# Altium schematic sheet Digital_GPIO.SchDoc: Digital GPIO
size A4; SheetNumber: 5; SheetTotal: 6
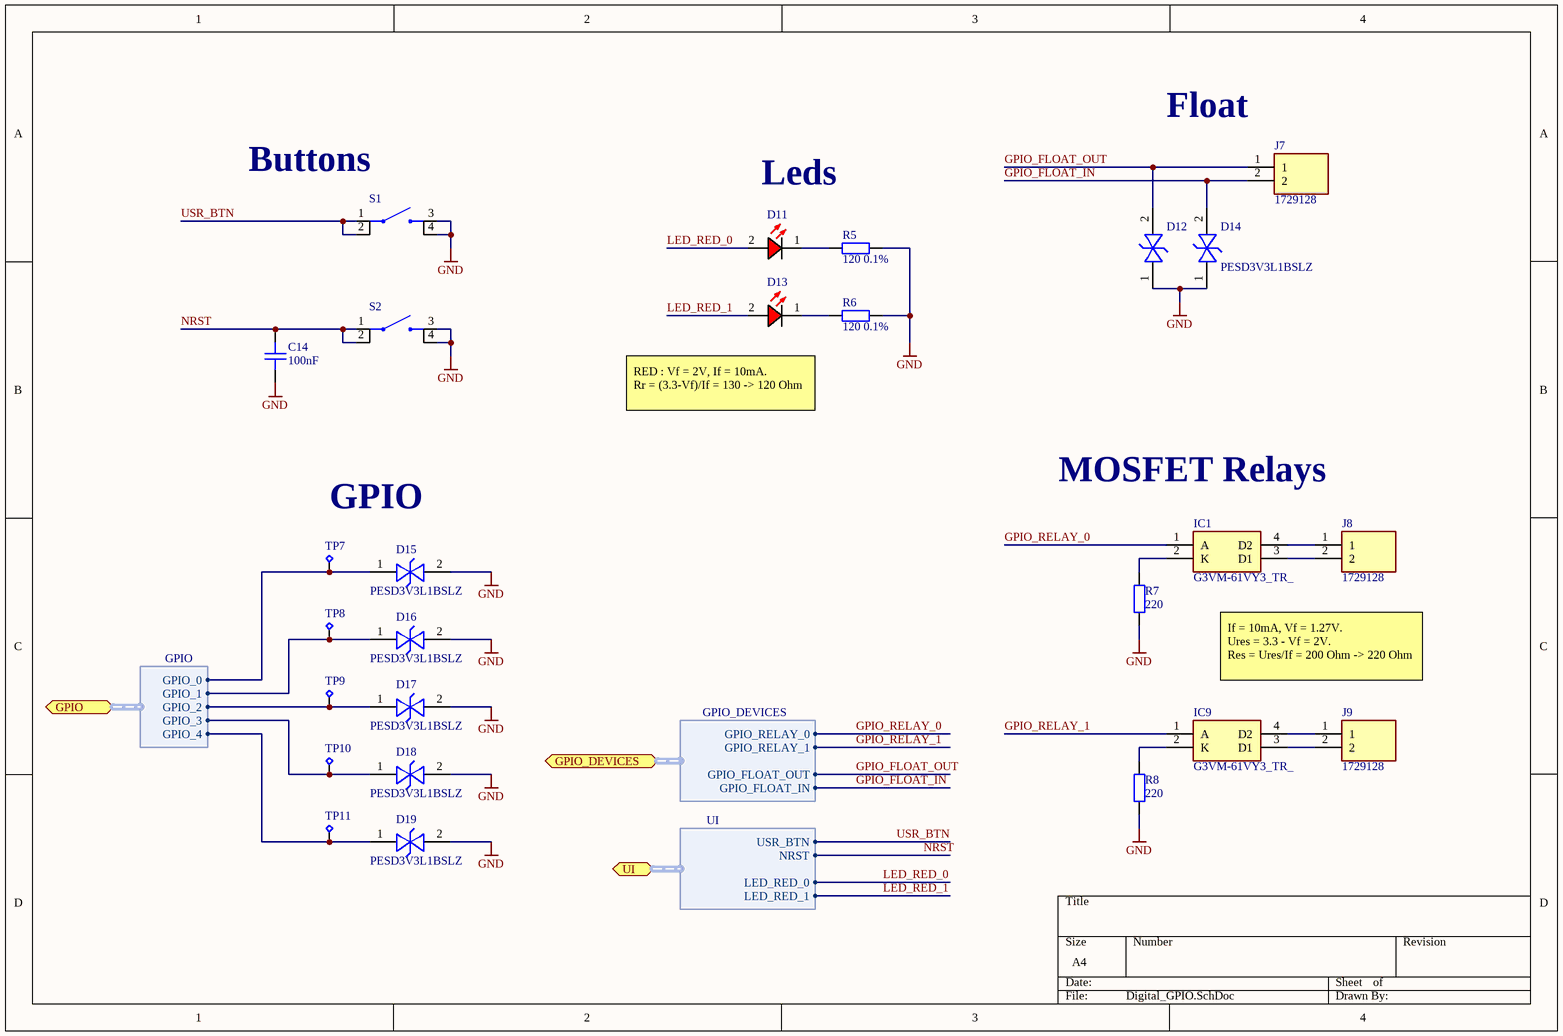
[diagram p0: Digital_GPIO.SchDoc]

## Parts
C14  100nF  [CAPC1005X05N]
D11  LTST-C171KRKT  [LTST-C171]  (value not drawn)
D12  PESD3V3L1BSLZ  [PESD3V3L1BSLZ]  (value not drawn)
D13  LTST-C171KRKT  [LTST-C171]  (value not drawn)
D14  PESD3V3L1BSLZ  [PESD3V3L1BSLZ]
D15  PESD3V3L1BSLZ  [PESD3V3L1BSLZ]
D16  PESD3V3L1BSLZ  [PESD3V3L1BSLZ]
D17  PESD3V3L1BSLZ  [PESD3V3L1BSLZ]
D18  PESD3V3L1BSLZ  [PESD3V3L1BSLZ]
D19  PESD3V3L1BSLZ  [PESD3V3L1BSLZ]
IC1  G3VM-61VY3_TR_  [G3VM61VY3TR]
IC9  G3VM-61VY3_TR_  [G3VM61VY3TR]
J7  1729128  [1729128]
J8  1729128  [1729128]
J9  1729128  [1729128]
R5  120 0.1%  [RESC2012X05N]
R6  120 0.1%  [RESC2012X05N]
R7  220  [RESC1608X04N]
R8  220  [RESC1608X04N]
S1  PTS645SL43SMTR92LFS  [PTS645SL43SMTR92LFS]  (value not drawn)
S2  PTS645SL43SMTR92LFS  [PTS645SL43SMTR92LFS]  (value not drawn)
TP7  5117  [5117]  (value not drawn)
TP8  5117  [5117]  (value not drawn)
TP9  5117  [5117]  (value not drawn)
TP10  5117  [5117]  (value not drawn)
TP11  5117  [5117]  (value not drawn)

## Ports
GPIO (bidir, harness GPIO), GPIO_DEVICES (bidir, harness GPIO_DEVICES), UI (bidir, harness UI)

## Harnesses
GPIO: GPIO_0, GPIO_1, GPIO_2, GPIO_3, GPIO_4
GPIO_DEVICES: GPIO_RELAY_0, GPIO_RELAY_1, GPIO_FLOAT_OUT, GPIO_FLOAT_IN
UI: USR_BTN, NRST, LED_RED_0, LED_RED_1

## Nets
GND: C14.2 D12.1(K1) D14.1(K1) D15.2(K2) D16.2(K2) D17.2(K2) D18.2(K2) D19.2(K2) R5.2 R6.2 R7.1 R8.1 S1.3 S1.4 S2.3 S2.4
GPIO_FLOAT_IN: D14.2(K2) J7.2 ; port GPIO_DEVICES.GPIO_FLOAT_IN
GPIO_FLOAT_OUT: D12.2(K2) J7.1 ; port GPIO_DEVICES.GPIO_FLOAT_OUT
GPIO_RELAY_0: IC1.1(A) ; port GPIO_DEVICES.GPIO_RELAY_0
GPIO_RELAY_1: IC9.1(A) ; port GPIO_DEVICES.GPIO_RELAY_1
LED_RED_0: D11.2(A) ; port UI.LED_RED_0
LED_RED_1: D13.2(A) ; port UI.LED_RED_1
NRST: C14.1 S2.1 S2.2 ; port UI.NRST
USR_BTN: S1.1 S1.2 ; port UI.USR_BTN
NetD11_1: D11.1(K) R5.1
NetD13_1: D13.1(K) R6.1
NetD15_1: D15.1(K1) TP7.1 ; port GPIO.GPIO_0
NetD16_1: D16.1(K1) TP8.1 ; port GPIO.GPIO_1
NetD17_1: D17.1(K1) TP9.1 ; port GPIO.GPIO_2
NetD18_1: D18.1(K1) TP10.1 ; port GPIO.GPIO_3
NetD19_1: D19.1(K1) TP11.1 ; port GPIO.GPIO_4
NetIC1_2: IC1.2(K) R7.2
NetIC1_3: IC1.3(D1) J8.2
NetIC1_4: IC1.4(D2) J8.1
NetIC9_2: IC9.2(K) R8.2
NetIC9_3: IC9.3(D1) J9.2
NetIC9_4: IC9.4(D2) J9.1

## Notes on the sheet
- (near S1) Buttons
- (near J7) Float
- Leds
- RED : Vf = 2V, If = 10mA.
  Rr = (3.3-Vf)/If = 130 -> 120 Ohm
- GPIO
- MOSFET Relays
- If = 10mA, Vf = 1.27V.
  Ures = 3.3 - Vf = 2V.
  Res = Ures/If = 200 Ohm -> 220 Ohm

## Library data of the parts
C14 = CMP-0003371-1: 100nF 10% 50V Ceramic Capacitor X8L 0402 (1005 Metric); Value: 100nF; Max Operating Temperature: 150°C; Case/Package: 0402 (1005 Metric); Temperature Coefficient: X8L; Mounting Technology: Surface Mount; Voltage Rating: 50V; Min Operating Temperature: -55°C; RoHS Compliant: Yes; Tolerance: 10%
D11 D13 = CMP-0002115-5: Single Color LED, Red, Water Clear, 1.4mm; Forward Voltage: 2V; Viewing Angle: 130°; Color: Red; Case/Package: 0805 (2012 Metric); Max Operating Temperature: 85°C; Mounting Technology: Surface Mount; RoHS Compliant: Yes; Min Operating Temperature: -55°C
D12 D14-D19 = PESD3V3L1BSLZ: Diode ESD (Bi-directional); Manufacturer_Name: Nexperia; Datasheet Link: https://assets.nexperia.com/documents/data-sheet/PESD3V3L1BSL.pdf; Height: 0.45mm; Manufacturer_Part_Number: PESD3V3L1BSLZ; Mouser Part Number: 771-PESD3V3L1BSLZ; Mouser Price/Stock: https://www.mouser.co.uk/ProductDetail/Nexperia/PESD3V3L1BSLZ?qs=Li%252BoUPsLEnsrB%2FnSgNrAWw%3D%3D
IC1 IC9 = G3VM-61VY3_TR_: Integrated Circuit; Manufacturer_Name: Omron Electronics; Manufacturer_Part_Number: G3VM-61VY3(TR); Datasheet Link: https://pt.mouser.com/datasheet/2/307/omron_04102018_G3VM-6_G__61VY1_DS_E-1317117.pdf; Height: 2.5mm; Mouser Part Number: 653-G3VM-61VY3TR; Mouser Price/Stock: https://www.mouser.co.uk/ProductDetail/Omron-Electronics/G3VM-61VY3TR?qs=F5EMLAvA7IDWDr%252BrEjvwmw%3D%3D; Arrow Part Number: G3VM-61VY3(TR); Arrow Price/Stock: https://www.arrow.com/en/products/g3vm-61vy3-tr/omron?utm_currency=USD&region=nac
J7-J9 = 1729128: Connector; Manufacturer_Name: Phoenix Contact; Datasheet Link: http://www.phoenixcontact.net/product/1729128; Height: 10.15mm; Manufacturer_Part_Number: 1729128; Mouser Part Number: 651-1729128; Mouser Price/Stock: https://www.mouser.co.uk/ProductDetail/Phoenix-Contact/1729128?qs=GFUSqQMLmmnCBVBY3dts9w%3D%3D; Arrow Part Number: 1729128; Arrow Price/Stock: https://www.arrow.com/en/products/1729128/phoenix-contact?region=nac; System: Connector
R5 = CMP-0005383-3: 120 Ohms ±0.1% 0.125W, 1/8W Chip Resistor 0805 (2012 Metric) Thin Film / RT0805BRD07120RL; Resistor Series: E24; Temperature Coefficient: 25ppm/°C; Value: 120; Power: 125mW; Voltage Rating: 150V; RoHS Compliant: Yes; Max Operating Temperature: 155°C; Case/Package: 0805 (2012 Metric); Mounting Technology: Surface Mount; Min Operating Temperature: -55°C; Tolerance: 0.1%
R6 = CMP-0005383-3: 120 Ohms ±0.1% 0.125W, 1/8W Chip Resistor 0805 (2012 Metric) Thin Film; Resistor Series: E24; Temperature Coefficient: 25ppm/°C; Value: 120; Power: 125mW; Voltage Rating: 150V; RoHS Compliant: Yes; Max Operating Temperature: 155°C; Case/Package: 0805 (2012 Metric); Mounting Technology: Surface Mount; Min Operating Temperature: -55°C; Tolerance: 0.1%
R7 R8 = CMP-0001959-3: 220 Ohms ±1% 0.1W, 1/10W Chip Resistor 0603 (1608 Metric) Moisture Resistant Thick Film; Temperature Coefficient: 200ppm/°C; Voltage Rating: 75V; Power: 100mW; Resistor Series: E24; Mounting Technology: Surface Mount; Case/Package: 0603 (1608 Metric); Min Operating Temperature: -55°C; RoHS Compliant: Yes; Max Operating Temperature: 155°C; Value: 220; Tolerance: 1%
S1 S2 = CMP-00001-2: Keypad Switch, 1 Switches, SPST, Momentary-tactile, 0.05A, 12VDC, 1.27N, 4 PCB Hole Cnt, Solder Terminal, Surface Mount-straight; Contact Current(DC)-Max: 50mA; Electrical Life: 100000Cycles; Actuator Type: Pushbutton; Circuit: SPST-NO; Max Operating Temperature: 60°C; Switch Type: Keypad; Min Operating Temperature: -20°C; Case/Package: 4-SMD; RoHS Compliant: Yes; Switch Function: SPST; Mounting Technology: Surface Mount
TP7-TP11 = CMP-0002617-2: PC TEST POINT MINIATURE BLUE; Colour: Blue; Max Operating Temperature: 125°C; Min Operating Temperature: -55°C; RoHS Compliant: Yes; Case/Package: Cylinder; Mounting Technology: Through Hole; NetName: NetName